# EAGLE schematic shield_romwriter (EAGLE 7.3.0)
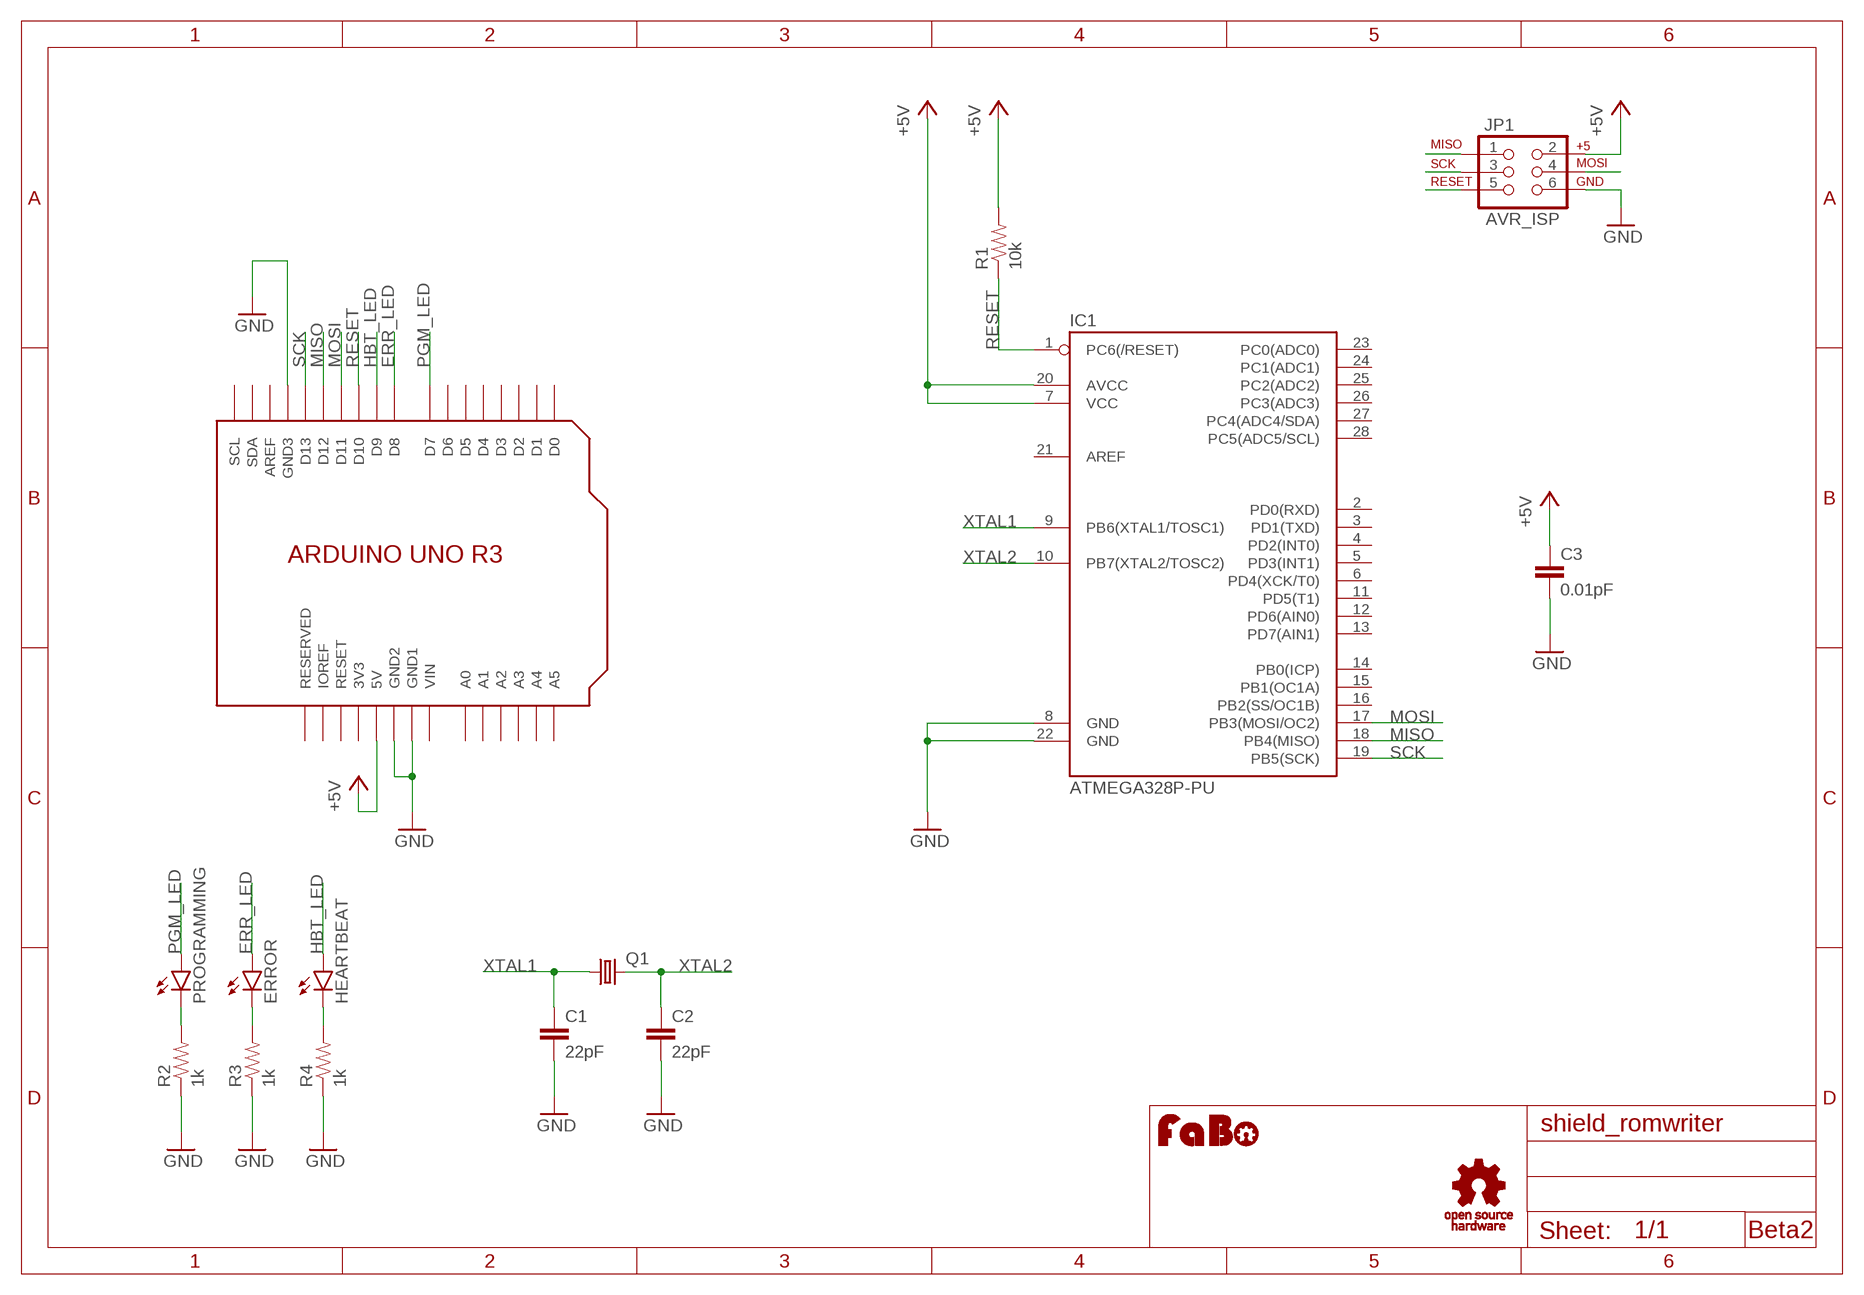
[diagram p0: schematic, sheet 1]

## Parts
C1  22pF  CAP-PTH-SMALL  [CAP-PTH-SMALL]
C2  22pF  CAP-PTH-SMALL  [CAP-PTH-SMALL]
C3  0.01pF  CAP-PTH-SMALL  [CAP-PTH-SMALL]
ERROR  LED3MM  [LED3MM]
HEARTBEAT  LED3MM  [LED3MM]
IC1  ATMEGA328P-PU  [DIL28]
JP1  AVR_ISP  AVR_SPI_PRG_62X3_LOCK  [2X3_LOCK]
PROGRAMMING  LED3MM  [LED3MM]
Q1  CRYSTALHC49S  [HC49/S]
R1  10k  RES-PTH-REGULAR  [RES-AXL-REGULAR]
R2  1k  RES-PTH-REGULAR  [RES-AXL-REGULAR]
R3  1k  RES-PTH-REGULAR  [RES-AXL-REGULAR]
R4  1k  RES-PTH-REGULAR  [RES-AXL-REGULAR]
U2  ARDUINO_UNO_R3_SHIELD-NOLABEL  [ARDUINO_UNO_R3_NOLABEL]
U$1  LOGO_FABO-M  [LOGO_FABO_M]
U$3  LOGO_OSHW_T-M  [LOGO_OSHW_T_M]

## Nets
+5V: C3.1 IC1.7(VCC) IC1.20(AVCC) JP1.2 R1.P$2 U2.5V
ERR_LED: ERROR.A U2.D8
GND: C1.2 C2.2 C3.2 IC1.8(GND) IC1.22(GND) JP1.6 R2.P$1 R3.P$1 R4.P$1 U2.GND1 U2.GND2 U2.GND3
HBT_LED: HEARTBEAT.A U2.D9
MISO: IC1.18(PB4(MISO)) JP1.1 U2.D12
MOSI: IC1.17(PB3(MOSI/OC2)) JP1.4 U2.D11
N$6: PROGRAMMING.K(C) R2.P$2
N$7: ERROR.K(C) R3.P$2
N$8: HEARTBEAT.K(C) R4.P$2
PGM_LED: PROGRAMMING.A U2.D7
RESET: IC1.1(PC6(/RESET)) JP1.5 R1.P$1 U2.D10
SCK: IC1.19(PB5(SCK)) JP1.3 U2.D13
XTAL1: C1.1 IC1.9(PB6(XTAL1/TOSC1)) Q1.1
XTAL2: C2.1 IC1.10(PB7(XTAL2/TOSC2)) Q1.2
Unconnected: IC1.2(PD0(RXD)) IC1.3(PD1(TXD)) IC1.4(PD2(INT0)) IC1.5(PD3(INT1)) IC1.6(PD4(XCK/T0)) IC1.11(PD5(T1)) IC1.12(PD6(AIN0)) IC1.13(PD7(AIN1)) IC1.14(PB0(ICP)) IC1.15(PB1(OC1A)) IC1.16(PB2(SS/OC1B)) IC1.21(AREF) IC1.23(PC0(ADC0)) IC1.24(PC1(ADC1)) IC1.25(PC2(ADC2)) IC1.26(PC3(ADC3)) IC1.27(PC4(ADC4/SDA)) IC1.28(PC5(ADC5/SCL)) U2.A0 U2.A1 U2.A2 U2.A3 U2.A4 U2.A5 U2.AREF U2.D0 U2.D1 U2.D2 U2.D3 U2.D4 U2.D5 U2.D6 U2.IOREF U2.RESERVED U2.RESET U2.SCL U2.SDA

## Notes on the sheet
- Beta2

## Power pins joined to a net without a drawn wire
3V3: U2.3V3
VIN: U2.VIN

## Library data of the parts
C1-C3 = GClue:CAP: Capacitor Standard 0603 ceramic capacitor
ERROR HEARTBEAT PROGRAMMING = SparkFun-LED:LED: LEDs Standard schematic elements and footprints for 5mm, 3mm, 1206, and 0603 sized LEDs. 5mm - Spark Fun Electronics SKU : COM-00529 (and others)
IC1 = GClue:ATMEGA328P-PU
JP1 = mylib:AVR_SPI_PRG_6: AVR ISP 6 Pin This is the reduced ISP connector for AVR programming. Common on Arduino. This footprint will take up less PCB space and can be used with a 10-pin to 6-pin adapter such as SKU: BOB-08508 **Special note about "TEST_POINT" package. The stop mask is on the top side, so if you want your programming test points to be on the bottom of your board, make sure to place this package on the bottom side of the board. This also ensure that the orientation to program from the bottom side will be correct.
Q1 = adafruit:CRYSTAL: CRYSTAL; OC_FARNELL: 1667008; OC_NEWARK: unknown
R1-R4 = GClue:RES
U2 = GClue:ARDUINO_UNO_R3_SHIELD
U$1 = FaBo:LOGO_FABO
U$3 = GClue:LOGO_OSHW_T

## Net classes
0 default: width 0.305 mm